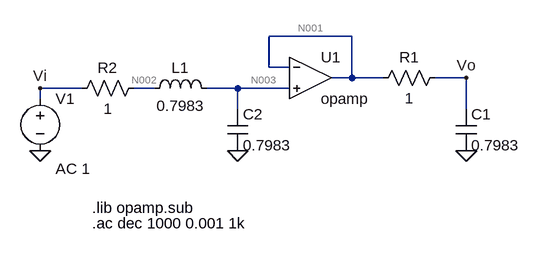
[diagram p0: schematic simulacion_RLC_normalizado_LTspice.asc]
simulacion_RLC_normalizado_LTspice.asc, the LTspice schematic file:
Version 4
SHEET 1 880 680
WIRE 272 80 144 80
WIRE 144 128 144 80
WIRE 176 128 144 128
WIRE 272 144 272 80
WIRE 272 144 240 144
WIRE 320 144 272 144
WIRE 448 144 400 144
WIRE -144 160 -208 160
WIRE -32 160 -64 160
WIRE 96 160 48 160
WIRE 176 160 96 160
WIRE -208 176 -208 160
WIRE 96 192 96 160
WIRE 448 192 448 144
FLAG 448 256 0
FLAG 96 256 0
FLAG -208 256 0
FLAG -208 160 Vi
FLAG 448 144 Vo
SYMBOL OpAmps\\opamp 208 80 R0
SYMATTR InstName U1
SYMBOL res -160 176 R270
WINDOW 0 32 56 VTop 2
WINDOW 3 0 56 VBottom 2
SYMATTR InstName R2
SYMATTR Value 1
SYMBOL ind -48 176 R270
WINDOW 0 32 56 VTop 2
WINDOW 3 5 56 VBottom 2
SYMATTR InstName L1
SYMATTR Value 0.7983
SYMBOL cap 80 192 R0
SYMATTR InstName C2
SYMATTR Value 0.7983
SYMBOL res 416 128 R90
WINDOW 0 0 56 VBottom 2
WINDOW 3 32 56 VTop 2
SYMATTR InstName R1
SYMATTR Value 1
SYMBOL cap 432 192 R0
SYMATTR InstName C1
SYMATTR Value 0.7983
SYMBOL voltage -208 160 R0
WINDOW 123 24 124 Left 2
WINDOW 39 0 0 Left 0
SYMATTR Value2 AC 1
SYMATTR InstName V1
SYMATTR Value ""
TEXT -128 344 Left 2 !.lib opamp.sub
TEXT -128 368 Left 2 !.ac dec 1000 0.001 1k

The netlist it stands for:
* simulacion_RLC_normalizado_LTspice.asc
XU1 N001 N003 N001 opamp Aol=100K GBW=10Meg  ; pins invin noninvin out
R2 Vi N002 1
L1 N002 N003 0.7983
C2 N003 0 0.7983
R1 Vo N001 1
C1 Vo 0 0.7983
V1 Vi 0 AC 1
.lib opamp.sub
.ac dec 1000 0.001 1k
.backanno
.end

* Results of the author's LTspice run, read from the files saved beside the schematic
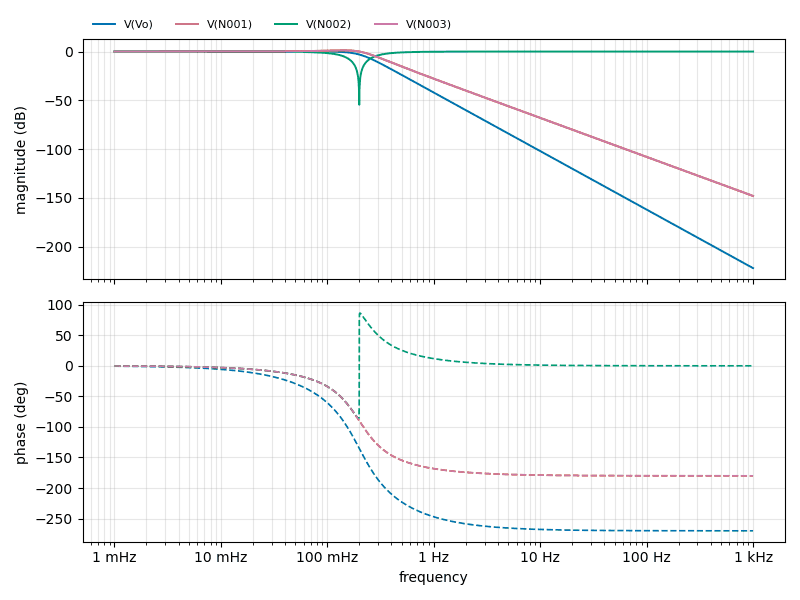
[diagram p1: AC Analysis of simulacion_RLC_normalizado_LTspice.asc, plotted from the saved traces]
* AC Analysis, 1 run:
*   V(Vo): -0.00 dB at 1 mHz, -222.02 dB at 1 kHz, peak -0.00 dB at 1 mHz, 3 dB below the peak at 199.2 mHz
*   V(N001): 0.00 dB at 1 mHz, -148.01 dB at 1 kHz, peak 1.24 dB at 140.9 mHz, 3 dB below the peak at 233 mHz
*   V(N002): -0.00 dB at 1 mHz, -0.00 dB at 1 kHz, peak -0.00 dB at 1 kHz, 3 dB below the peak at 322.7 mHz
*   V(N003): 0.00 dB at 1 mHz, -148.01 dB at 1 kHz, peak 1.24 dB at 140.9 mHz, 3 dB below the peak at 233 mHz